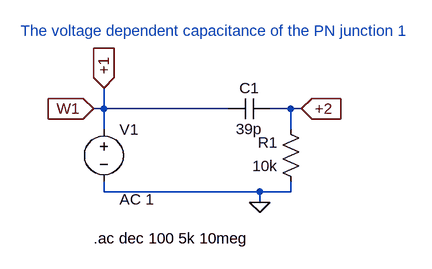
[diagram p0: schematic v_dep_pn1.asc]
v_dep_pn1.asc, the LTspice schematic file:
Version 4
SHEET 1 880 680
WIRE -208 112 -208 80
WIRE -208 112 -224 112
WIRE -16 112 -208 112
WIRE 80 112 48 112
WIRE 96 112 80 112
WIRE -208 144 -208 112
WIRE 80 144 80 112
WIRE -208 240 -208 224
WIRE 32 240 -208 240
WIRE 80 240 80 224
WIRE 80 240 32 240
WIRE 32 256 32 240
FLAG 32 256 0
FLAG -224 112 W1
IOPIN -224 112 In
FLAG 96 112 +2
IOPIN 96 112 In
FLAG -208 80 +1
IOPIN -208 80 In
SYMBOL res 96 240 R180
WINDOW 0 36 76 Left 2
WINDOW 3 36 40 Left 2
SYMATTR InstName R1
SYMATTR Value 10k
SYMBOL cap 48 96 R90
WINDOW 0 0 32 VBottom 2
WINDOW 3 32 32 VTop 2
SYMATTR InstName C1
SYMATTR Value 39p
SYMBOL voltage -208 128 R0
WINDOW 123 24 124 Left 2
WINDOW 39 0 0 Left 0
SYMATTR Value2 AC 1
SYMATTR InstName V1
SYMATTR Value ""
TEXT -224 312 Left 2 !.ac dec 100 5k 10meg
TEXT -336 -8 Left 2 ;The voltage dependent capacitance of the PN junction 1

The netlist it stands for:
* v_dep_pn1.asc
R1 0 +2 10k
C1 +2 +1 39p
V1 +1 0 AC 1
.ac dec 100 5k 10meg
* The voltage dependent capacitance of the PN junction 1
.backanno
.end